# EasyEDA Pro project CH32V203C8T6采样模块.eprj, board 主拓展板PCB
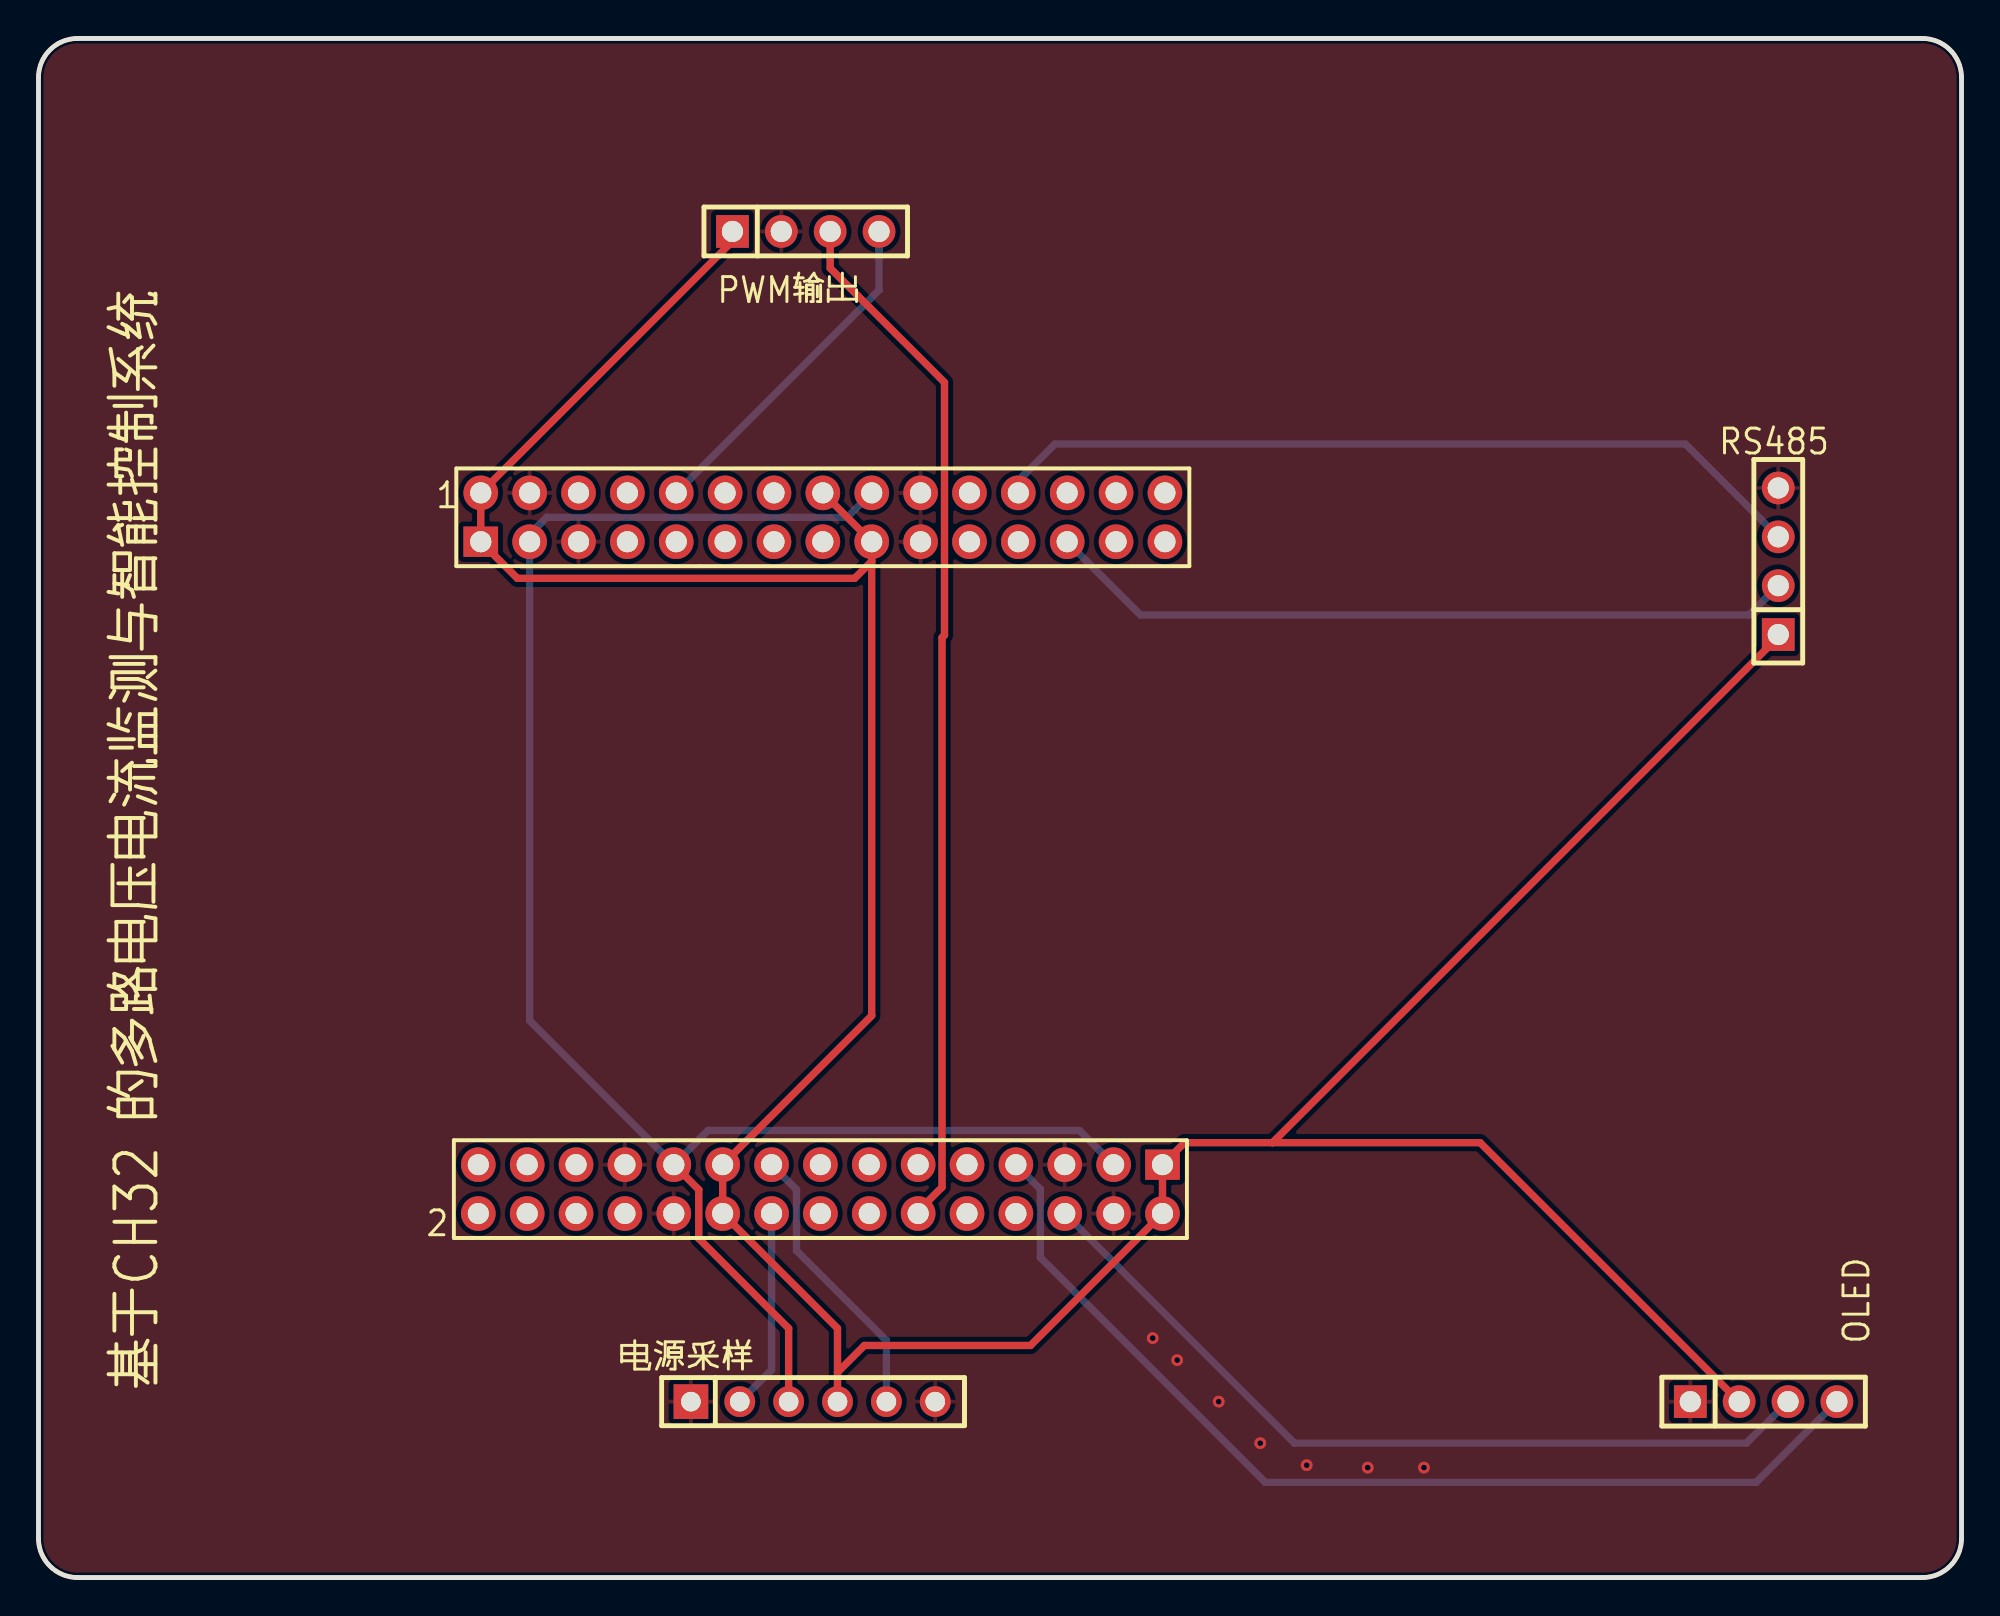
[diagram p3: board, top side]
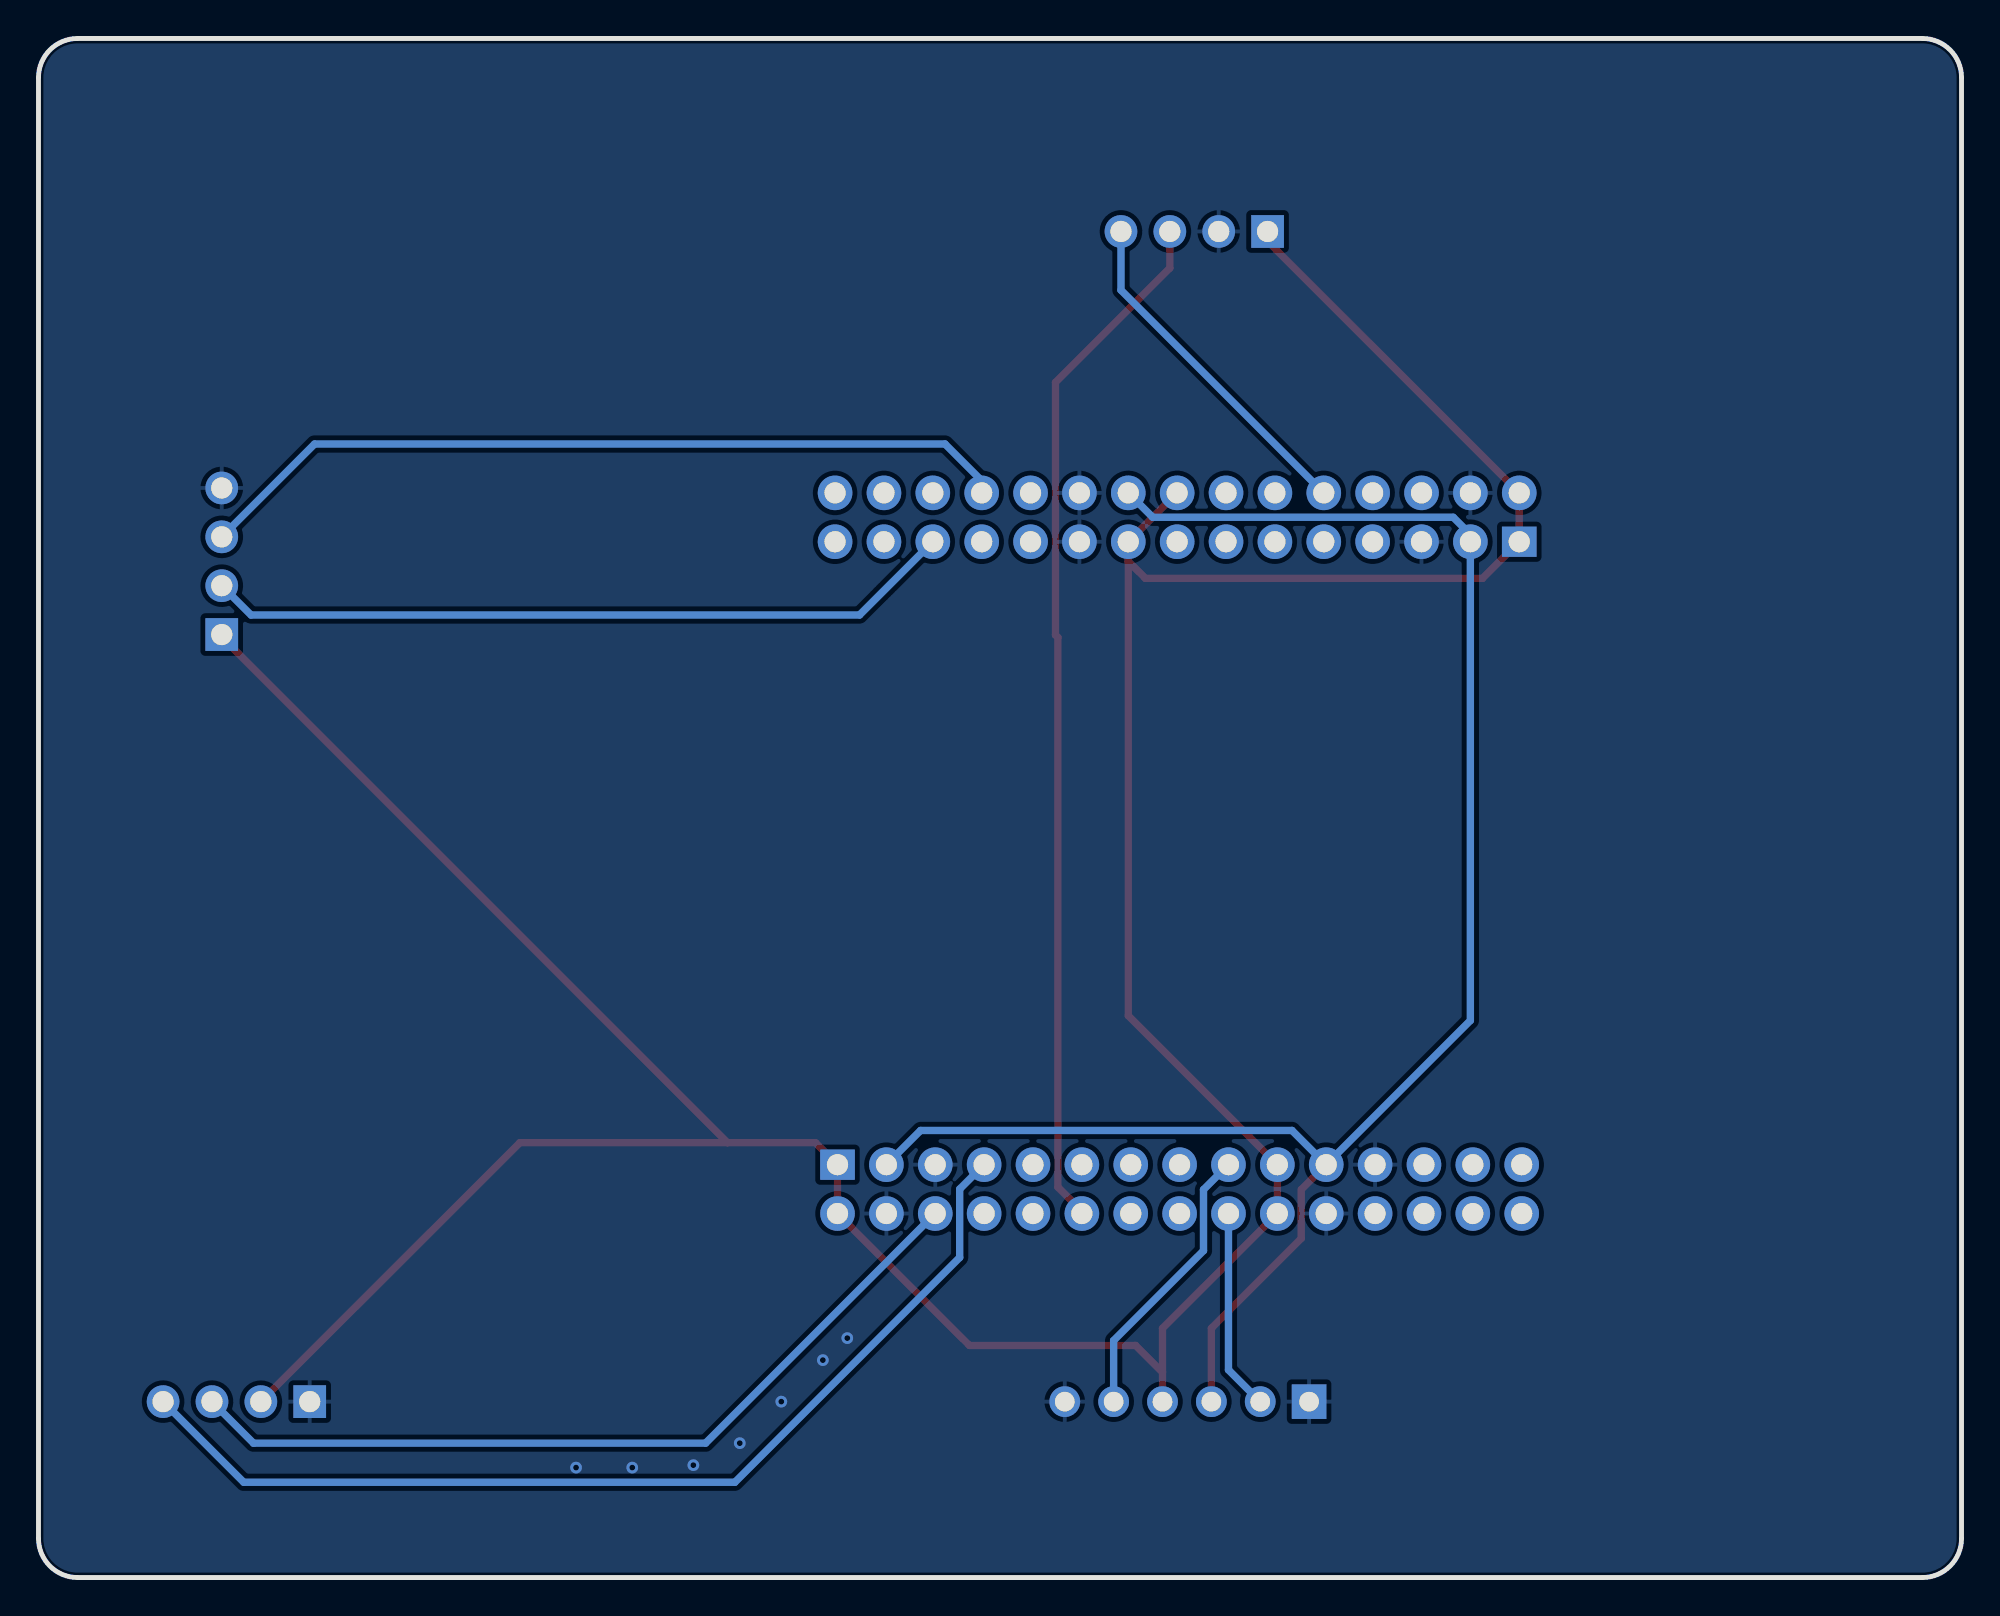
[diagram p4: board, bottom side, seen from below]

Outline 99.95 x 80.01 mm; copper layers: Top Layer, Bottom Layer. Coordinates in mm from the lower left corner of the outline.
Outline path: 0,77.98 0,2.03 arc(0.6,0.6) 2.03,0 97.92,0 arc(99.35,0.6) 99.95,2.03 99.95,77.98 arc(99.35,79.41) 97.92,80.01 2.03,80.01 arc(0.6,79.41) 0,77.98
Stack: Top Layer 0.035mm / Dielectric1 1.51mm FR4 er 4.5 / Bottom Layer 0.035mm

## Design rules (mm)
template: JLCPCB Capability(Two Layers Board)
spacing copperThickness1oz (default): track to track 0.102, other pairs 0.152 to 0.3
spacing copperThickness2oz: track to track 0.203, other pairs 0.152 to 0.3
track width copperThickness1oz (default): min 0.127, default 0.254, max 2.54
track width copperThickness2oz: min 0.203, default 0.254, max 2.54
differential pair differentialPair (default): width min 0.127, default 0.254, max 2.54; gap min 0.152, default 0.152
via viaSize (default): diameter min 0.5, default 0.61, max 10; hole min 0.3, default 0.305, max 6.3

## Placement (name value [footprint] x y rotation side)
1  COM2X15_2.54_DIP  [HDR-TH_30P-P2.54-V-M-R2-C15-S2.54]  40.77 55.12 0 top
2  COM2X15_2.54_DIP  [HDR-TH_30P-P2.54-V-M-R2-C15-S2.54]  40.64 20.19 180 top
OLED  PM2.54-1*4  [HDR-TH_4P-P2.54-V-F]  89.66 9.14 0 top
PWM输出  PM2.54-1*4  [HDR-TH_4P-P2.54-V-F]  39.88 69.98 0 top
RS485  RS485  [HDR-TH_4P-P2.54-V-F]  90.42 52.83 90 top
电源采样  2.54-1*6P母  [HDR-TH_6P-P2.54-V-F]  40.26 9.14 0 top

## Footprints (pads in the part's own frame, mm; a bottom-side part is the same pattern mirrored in y, then rotated)
HDR-TH_4P-P2.54-V-F
  rect 1.7x1.7 hole 1.1: 1(-3.81,0)
  round 1.7 hole 1.1: 2(-1.27,0) 3(1.27,0) 4(3.81,0)
HDR-TH_6P-P2.54-V-F
  rect 1.8x1.8 hole 1.02: 1(-6.35,0)
  round 1.6 hole 1.02: 2(-3.81,0) 3(-1.27,0) 4(1.27,0) 5(3.81,0) 6(6.35,0)
HDR-TH_30P-P2.54-V-M-R2-C15-S2.54
  rect 1.8x1.575 hole 1.1: 1(-17.78,-1.27)
  round 1.8 hole 1.1: 2(-17.78,1.27) 3(-15.24,-1.27) 4(-15.24,1.27) 5(-12.7,-1.27) 6(-12.7,1.27) 7(-10.16,-1.27) 8(-10.16,1.27) 9(-7.62,-1.27) 10(-7.62,1.27) 11(-5.08,-1.27) 12(-5.08,1.27) 13(-2.54,-1.27) 14(-2.54,1.27) 15(0,-1.27) 16(0,1.27) 17(2.54,-1.27) 18(2.54,1.27) 19(5.08,-1.27) 20(5.08,1.27) 21(7.62,-1.27) 22(7.62,1.27) 23(10.16,-1.27) 24(10.16,1.27) 25(12.7,-1.27) 26(12.7,1.27) 27(15.24,-1.27) 28(15.24,1.27) 29(17.78,-1.27) 30(17.78,1.27)

## Nets
As in the schematic.

Pads without a net: 1 8; 2 8 24 30

## Via types
v1: diameter 0.61, hole 0.305, Top Layer to Bottom Layer, 7 vias

## Routing (per net, layer and track width the routed paths; a pad name or vN(x,y) marks a point on that pad's centre or on a via; arc(x,y) is an arc through that point)
GND:
  vias: v1(57.91,12.45) v1(59.18,11.3) v1(61.34,9.14) v1(63.5,6.98) v1(65.91,5.84) v1(69.09,5.71) v1(72.01,5.71)
VCC: length 193.2
  Top Layer w0.381: 41.53,10.67 42.93,12.06 51.56,12.06 2.2 2.1 59.56,22.61 64.14,22.61 ; 41.53,10.67 41.53,12.95 35.56,18.92 35.56,21.46 43.31,29.21 43.31,52.83 ; 41.53,10.67 电源采样.4 ; 43.31,52.83 43.31,53.85 1.16 ; 43.31,52.83 42.42,51.94 24.89,51.94 22.99,53.85 1.2 36.07,69.47 PWM输出.1 ; 64.14,22.61 74.93,22.61 88.39,9.14 ; 64.14,22.61 90.42,48.89 RS485.1
VIN: length 93.7
  Top Layer w0.381: 电源采样.3 38.99,12.95 34.32,17.63 34.32,20.17 2.21
  Bottom Layer w0.381: 1.18 42.04,55.12 26.42,55.12 25.53,54.23 25.53,28.96 2.21 34.8,23.24 54.1,23.24 2.3
PA0: length 10.5
  Bottom Layer w0.381: 2.18 38.1,10.79 电源采样.2
PA1: length 14.8
  Bottom Layer w0.381: 电源采样.5 44.07,12.32 39.4,16.99 39.4,20.17 2.17
PA6: length 54.1
  Top Layer w0.381: 2.12 45.72,19.05 46.96,20.29 46.96,48.87 47.09,48.99 47.09,62.13 41.15,68.07 PWM输出.3
PA9: length 39.2
  Bottom Layer w0.381: RS485.2 88.9,50.04 57.28,50.04 53.47,53.85
PA10: length 42.9
  Bottom Layer w0.381: 1.24 50.93,57.02 52.83,58.93 85.6,58.93 RS485.3
PB6: length 18
  Bottom Layer w0.381: PWM输出.4 43.69,66.93 1.10
PB10: length 53.3
  Bottom Layer w0.381: OLED.4 89.28,4.95 63.75,4.95 52.07,16.64 52.07,20.19 2.7
PB11: length 43.4
  Bottom Layer w0.381: OLED.3 88.77,6.98 65.28,6.98 53.34,18.92

## Copper pours and planes (outline as drawn; the poured copper is in the pictures)
GND on Top Layer: -0.13,78.1 -0.12,78.28 -0.07,78.56 0.01,78.83 0.13,79.09 0.28,79.33 0.47,79.54 0.68,79.73 0.92,79.88 1.18,80 1.45,80.08 1.73,80.13 1.91,80.14 98.04,80.14 98.22,80.13 98.5,80.08 98.77,80 99.03,79.88 99.27,79.73 99.48,79.54 99.67,79.33 99.82,79.09 99.94,78.83 100.02,78.56 100.07,78.28 100.08,78.1 100.08,1.91 100.07,1.73 100.02,1.45 99.94,1.18 99.82,0.92 99.67,0.68 99.48,0.47 99.27,0.28 99.03,0.13 98.77,0.01 98.5,-0.07 98.22,-0.12 98.04,-0.13 1.91,-0.13 1.73,-0.12 1.45,-0.07 1.18,0.01 0.92,0.13 0.68,0.28 0.47,0.47 0.28,0.68 0.13,0.92 0.01,1.18 -0.07,1.45 -0.12,1.73 -0.13,1.91
GND on Bottom Layer: -0.13,78.1 -0.12,78.28 -0.07,78.56 0.01,78.83 0.13,79.09 0.28,79.33 0.47,79.54 0.68,79.73 0.92,79.88 1.18,80 1.45,80.08 1.73,80.13 1.91,80.14 98.04,80.14 98.22,80.13 98.5,80.08 98.77,80 99.03,79.88 99.27,79.73 99.48,79.54 99.67,79.33 99.82,79.09 99.94,78.83 100.02,78.56 100.07,78.28 100.08,78.1 100.08,1.91 100.07,1.73 100.02,1.45 99.94,1.18 99.82,0.92 99.67,0.68 99.48,0.47 99.27,0.28 99.03,0.13 98.77,0.01 98.5,-0.07 98.22,-0.12 98.04,-0.13 1.91,-0.13 1.73,-0.12 1.45,-0.07 1.18,0.01 0.92,0.13 0.68,0.28 0.47,0.47 0.28,0.68 0.13,0.92 0.01,1.18 -0.07,1.45 -0.12,1.73 -0.13,1.91

## Text on the board
Top Silkscreen Layer: 基于CH32 的多路电压电流监测与智能控制系统
